# Altium schematic sheet STM32F103.SchDoc
size A4; DocumentNumber: 4; SheetNumber: 4; SheetTotal: 4
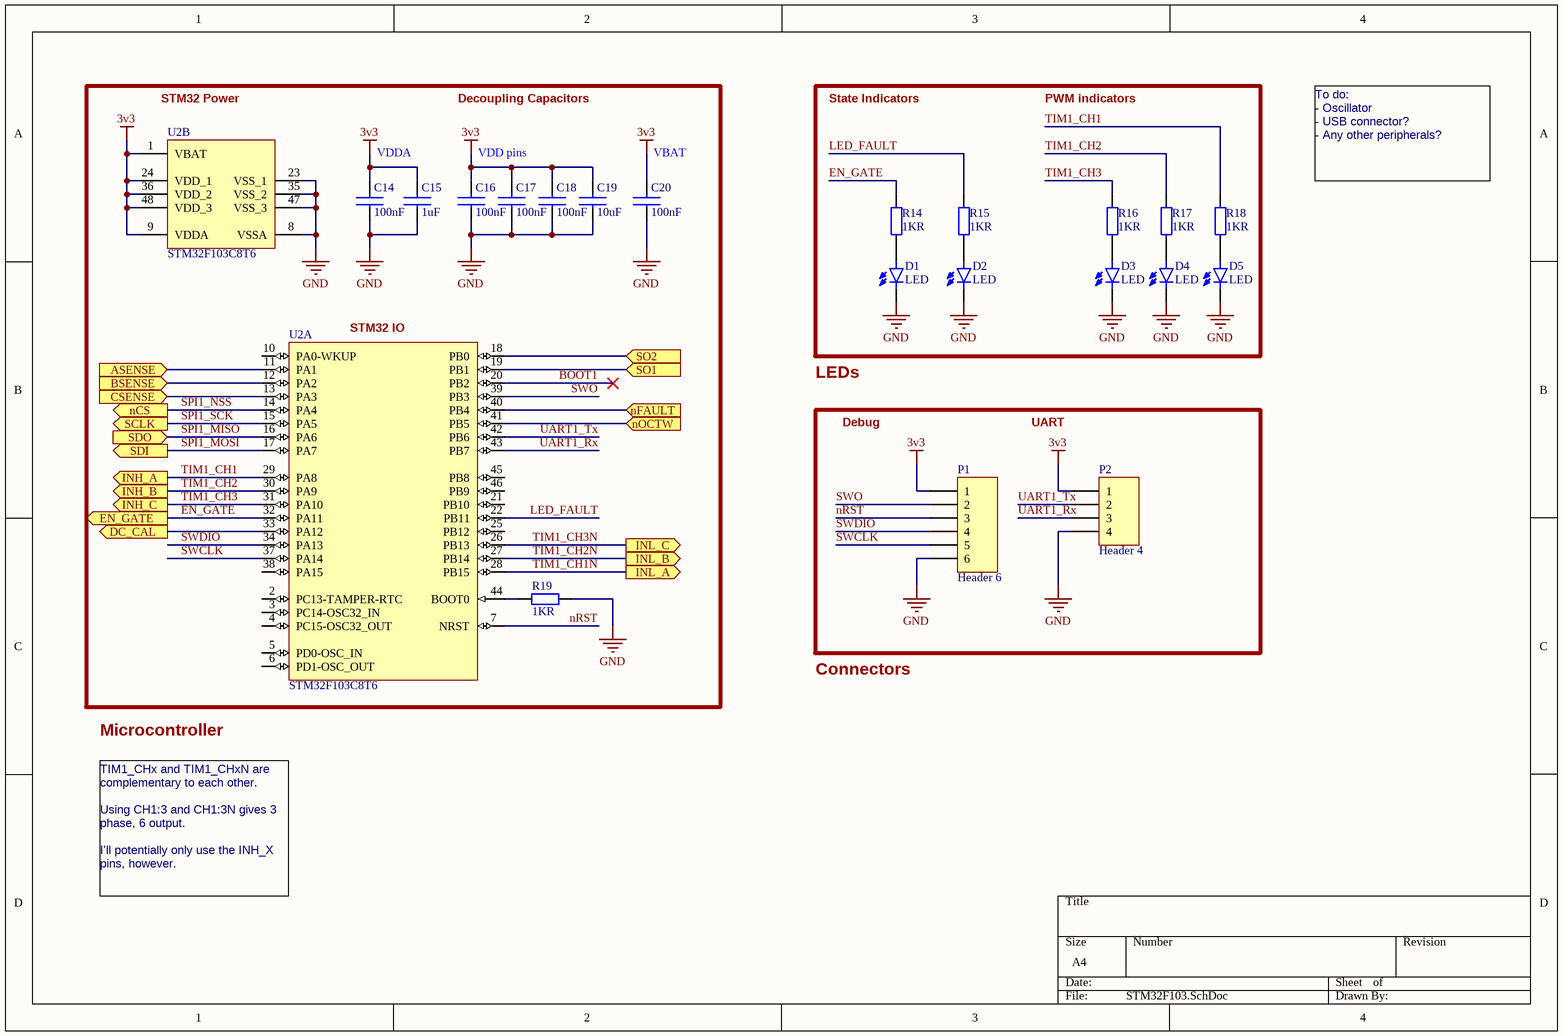
[diagram p0: STM32F103.SchDoc]

## Parts
C14  100nF  [RESC0603(1608)_N]
C15  1uF  [RESC0603(1608)_N]
C16  100nF  [RESC0603(1608)_N]
C17  100nF  [RESC0603(1608)_N]
C18  100nF  [RESC0603(1608)_N]
C19  10uF  [RESC0603(1608)_N]
C20  100nF  [RESC0603(1608)_N]
D1  LED  [0603]
D2  LED  [0603]
D3  LED  [0603]
D4  LED  [0603]
D5  LED  [0603]
P1  Header 6  [HDR1X6]
P2  Header 4  [HDR1X4]
R14  1KR  [RESC0603(1608)_N]
R15  1KR  [RESC0603(1608)_N]
R16  1KR  [RESC0603(1608)_N]
R17  1KR  [RESC0603(1608)_N]
R18  1KR  [RESC0603(1608)_N]
R19  1KR  [RESC0603(1608)_N]
U2  STM32F103C8T6  [STM-LQFP48_N]  (parts A,B of 2)

## Ports
ASENSE (in), BSENSE (in), CSENSE (in), DC_CAL (out), EN_GATE (out), INH_A (out), INH_B (out), INH_C (out), INL_A (out), INL_B (out), INL_C (out), nCS (out), nFAULT (in), nOCTW (in), SCLK (out), SDI (out), SDO (in), SO1 (in), SO2 (in)

## Nets
3v3: C14.2 C15.2 C16.2 C17.2 C18.2 C19.2 C20.2 P1.1 P2.1 U2.1(VBAT) U2.9(VDDA) U2.24(VDD_1) U2.36(VDD_2) U2.48(VDD_3)
GND: C14.1 C15.1 C16.1 C17.1 C18.1 C19.1 C20.1 D1.1 D2.1 D3.1 D4.1 D5.1 P1.6 P2.4 R19.2 U2.8(VSSA) U2.23(VSS_1) U2.35(VSS_2) U2.47(VSS_3)
ASENSE: U2.11(PA1) ; port ASENSE
BOOT1: U2.20(PB2)
BSENSE: U2.12(PA2) ; port BSENSE
CSENSE: U2.13(PA3) ; port CSENSE
DC_CAL: U2.33(PA12) ; port DC_CAL
EN_GATE: R14.1 U2.32(PA11) ; port EN_GATE
LED_FAULT: R15.1 U2.22(PB11)
nFAULT: U2.40(PB4) ; port nFAULT
nOCTW: U2.41(PB5) ; port nOCTW
nRST: P1.3 U2.7(NRST)
SO1: U2.19(PB1) ; port SO1
SO2: U2.18(PB0) ; port SO2
SPI1_MISO: U2.16(PA6) ; port SDO
SPI1_MOSI: U2.17(PA7) ; port SDI
SPI1_NSS: U2.14(PA4) ; port nCS
SPI1_SCK: U2.15(PA5) ; port SCLK
SWCLK: P1.5 U2.37(PA14)
SWDIO: P1.4 U2.34(PA13)
SWO: P1.2 U2.39(PB3)
TIM1_CH1: R18.1 U2.29(PA8) ; port INH_A
TIM1_CH1N: U2.28(PB15) ; port INL_A
TIM1_CH2: R17.1 U2.30(PA9) ; port INH_B
TIM1_CH2N: U2.27(PB14) ; port INL_B
TIM1_CH3: R16.1 U2.31(PA10) ; port INH_C
TIM1_CH3N: U2.26(PB13) ; port INL_C
UART1_Rx: P2.3 U2.43(PB7)
UART1_Tx: P2.2 U2.42(PB6)
NetD1_2: D1.2 R14.2
NetD2_2: D2.2 R15.2
NetD3_2: D3.2 R16.2
NetD4_2: D4.2 R17.2
NetD5_2: D5.2 R18.2
NetR19_1: R19.1 U2.44(BOOT0)

Not connected (* = marked no-connect by the designer): U2 2(PC13-TAMPER-RTC) 3(PC14-OSC32_IN) 4(PC15-OSC32_OUT) 5(PD0-OSC_IN) 6(PD1-OSC_OUT) 10(PA0-WKUP) 21(PB10) 25(PB12) 38(PA15) 45(PB8) 46(PB9)

## Notes on the sheet
- (near U2) STM32 Power
- Decoupling Capacitors
- State Indicators
- PWM indicators
- VDDA
- VDD pins
- (near C20) VBAT
- To do:
  - Oscillator
  - USB connector?
  - Any other peripherals?
- (near U2) STM32 IO
- LEDs
- Debug
- UART
- Connectors
- Microcontroller
- TIM1_CHx and TIM1_CHxN are complementary to each other.
  Using CH1:3 and CH1:3N gives 3 phase, 6 output.
  I'll potentially only use the INH_X pins, however.

## Library data of the parts
C14-C20 = Capacitor: Non polarized capacitor; Manufacturer: *; Mounting Technology: Surface Mount; PartNumber: *; Digikey Part Number: *
P1 = Header 6: Header, 6-Pin; LatestRevisionDate: 17-Jul-2002; LatestRevisionNote: Re-released for DXP Platform.; Publisher: Altium Limited
P2 = Header 4: Header, 4-Pin; LatestRevisionDate: 17-Jul-2002; LatestRevisionNote: Re-released for DXP Platform.; Publisher: Altium Limited
R14-R19 = Resistor: ComponentLink1Description: Land patterns; ComponentLink1URL: https://www.vishay.com/docs/60119/landpatterns.pdf; PartNumber: *; Manufacturer: *; Mounting Technology: Surface Mount; Digikey Part Number: *; ComponentLink2Description: 1k digikey; ComponentLink2URL: https://www.digikey.com.au/product-detail/en/yageo/RC0603JR-071KL/311-1.0KGRCT-ND/729624; ComponentLink3Description: shunt digikey; ComponentLink3URL: https://www.digikey.com.au/product-detail/en/yageo/PF1206FRF070R02L/311-0.02AJCT-ND/2178365
U2 = STM32F103C8T6: ARM Cortex-M3 32-bit MCU, 64 KB Flash, 20 KB Internal RAM, 37 I/Os, 48-pin LQFP, -40 to 85 degC, Tray; A/D Converter: 2x12-bit (10 Channel); FLASH Size (Prog) (kB): 64; I/Os (High Current): 37; Internal RAM Size (kB): 20; Operating Frequency(F) (Processor speed) (MHz): 72; Supply Voltage(Vcc) min (V): 2; DatasheetVersion: Rev. 16; PackageVersion: Rev. 6, 06/2013; PackageReference: LQFP48; PackageDescription: 48-Pin Low Profile Quad Flat Package, 7 x 7 mm Body, 0.5 mm Pitch; Supplier 1: Digi-Key; Supplier Part Number 1: 497-6063-ND; Supplier 2: Farnell; Supplier Part Number 2: 1447637; Supplier 3: Newark; Supplier Part Number 3: 59M2182; Supplier 4: Newark; Supplier Part Number 4: 57P1222; Supplier 5: Mouser; Supplier Part Number 5: 511-STM32F103C8T6; Core: ARM Cortex-M3; Packing: Tray; Mounting Technology: Surface Mount; PartNumber: STM32F103C8T6; ComponentLink1Description: Manufacturer URL; ComponentLink1URL: http://www.st.com/web/en/home.html; ComponentLink2Description: Datasheet; ComponentLink2URL: http://www.st.com/st-web-ui/static/active/en/resource/technical/document/datasheet/CD00161566.pdf; ComponentLink3Description: Package Specification; ComponentLink3URL: http://www.st.com/st-web-ui/static/active/en/resource/technical/document/datasheet/DM00058181.pdf
D1-D5 = LED: PartNumber: *; Manufacturer: *; Mounting Technology: Surface Mount; Digikey Part Number: *